# Altium schematic sheet Sheet3.SchDoc
size A
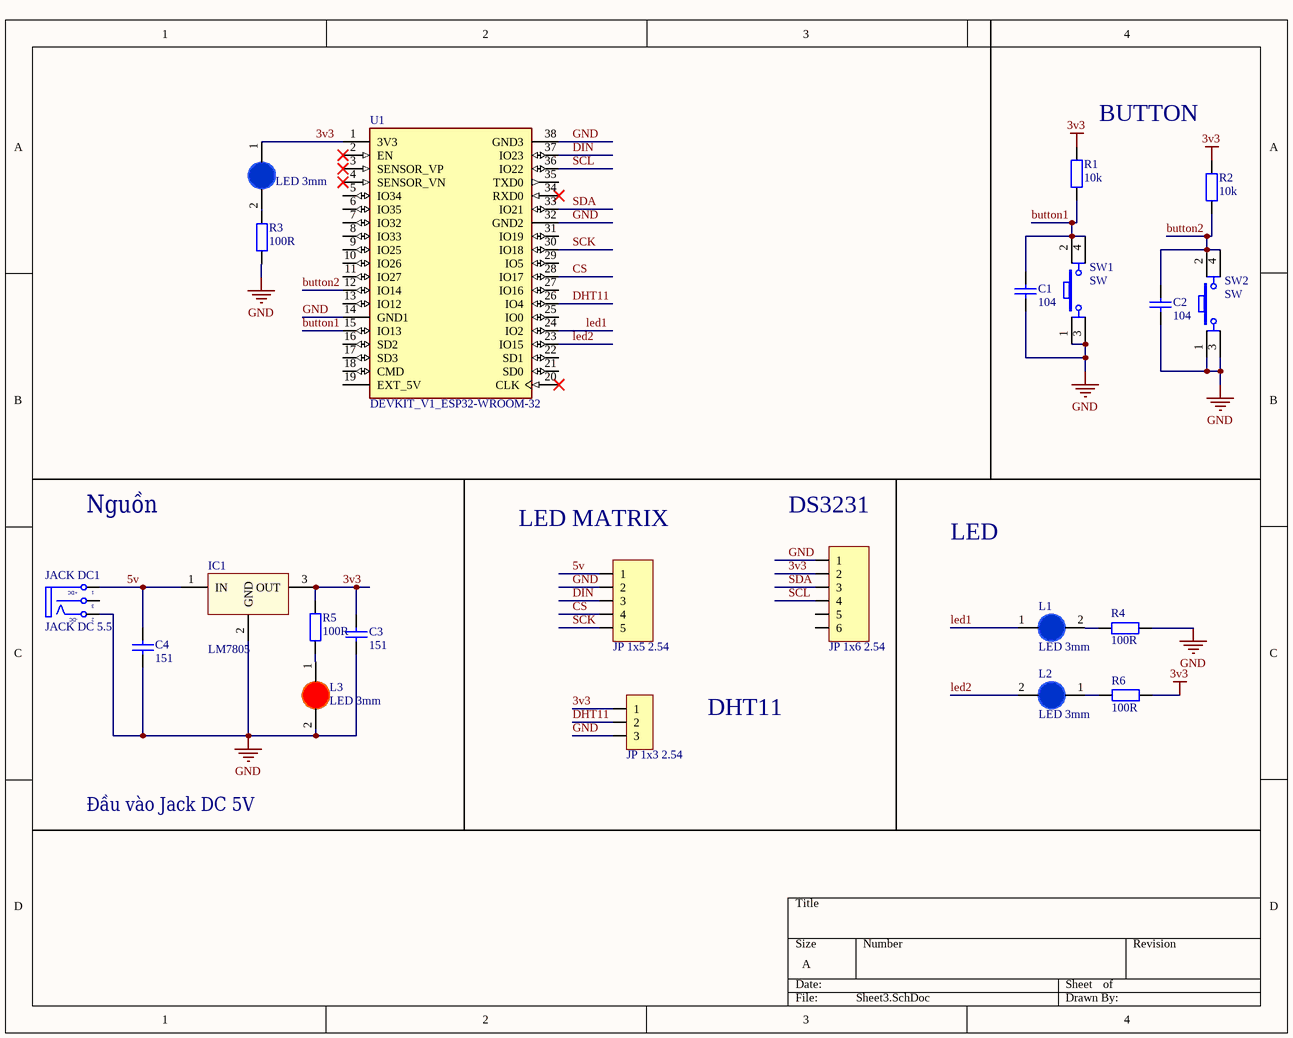
[diagram p0: Sheet3.SchDoc]

## Parts
?  LED 3mm  [LED-3MM-BLUE]
C1  104  [tu gom]
C2  104  [tu gom]
C3  151  [tu gom]
C4  151  [tu gom]
IC1  LM7805  [QTO-220H3]
JACK_DC1  JACK DC 5.5  [JACK DC 5.5]
JP1  JP 1x6 2.54  [JP 1x6 DT]
JP2  JP 1x5 2.54  [JP 1x5 DT]
JP3  JP 1x3 2.54  [JP 1x3 CT]
L1  LED 3mm  [LED-3MM-BLUE]
L2  LED 3mm  [LED-3MM-BLUE]
L3  LED 3mm  [LED-3MM-RED]
R1  10k  [tro vach 1/4w]
R2  10k  [tro vach 1/4w]
R3  100R  [tro vach 1/4w]
R4  100R  [tro vach 1/4w]
R5  100R  [tro vach 1/4w]
R6  100R  [tro vach 1/4w]
SW1  SW  [SW4]
SW2  SW  [SW4]
U1  DEVKIT_V1_ESP32-WROOM-32  [MODULE_DEVKIT_V1_ESP32-WROOM-32]

## Nets
3v3: ?.1(A) C3.1 IC1.3(OUT) JP1.2 JP3.1 R1.2 R2.2 R5.2 R6.1 U1.1(3V3)
GND: C1.2 C2.2 C3.2 C4.2 IC1.2(GND) JACK_DC1.2(TN) JP1.1 JP2.2 JP3.3 L3.2(K) R3.2 R4.1 SW1.1 SW1.3 SW2.1 SW2.3 U1.14(GND1) U1.32(GND2) U1.38(GND3)
5v: C4.1 IC1.1(IN) JACK_DC1.1(T) JP2.1
button1: C1.1 R1.1 SW1.2 SW1.4 U1.15(IO13)
button2: C2.1 R2.1 SW2.2 SW2.4 U1.12(IO14)
CS: JP2.4 U1.28(IO17)
DHT11: JP3.2 U1.26(IO4)
DIN: JP2.3 U1.37(IO23)
led1: L1.1(A) U1.24(IO2)
led2: L2.2(K) U1.23(IO15)
SCK: JP2.5 U1.30(IO18)
SCL: JP1.4 U1.36(IO22)
SDA: JP1.3 U1.33(IO21)
Net?_2: ?.2(K) R3.1
NetL1_2: L1.2(K) R4.2
NetL2_1: L2.1(A) R6.2
NetL3_1: L3.1(A) R5.1

Not connected (* = marked no-connect by the designer): JACK_DC1 3(S); JP1 5 6; U1 2(EN)* 3(SENSOR_VP)* 4(SENSOR_VN)* 5(IO34) 6(IO35) 7(IO32) 8(IO33) 9(IO25) 10(IO26) 11(IO27) 13(IO12) 16(SD2) 17(SD3) 18(CMD) 19(EXT_5V) 20(CLK)* 21(SD0) 22(SD1) 25(IO0) 27(IO16) 29(IO5) 31(IO19) 34(RXD0)* 35(TXD0)

## Notes on the sheet
- BUTTON
- Nguồn
- (near JP1) DS3231
- (near JP2) LED MATRIX
- LED
- DHT11
- Đầu vào Jack DC 5V
- (in symbol JACK DC 5.5) +DC; -DC

## Library data of the parts
? L1 L2 = LED 3mm Xanh Duong: Cắm; Don_Vi: Con; Ma_Hang: MH009003; Ten_Linh_Kien: LED 3MM Xanh Dương SS (1000c); Ghi_Chu: *; Kieu_Chan: *; Chung_Loai: Cắm
C1 C2 = Tu gom 104 50V: Cắm; So_Chan: 2; Ten_Linh_Kien: Tụ gốm 104 100nF 50V; Don_Vi: Con; Ma_Hang: MH004761; Chung_Loai: Cắm; Kieu_Chan: *
C3 C4 = Tu gom 151 50V: Cắm; So_Chan: 2; Don_Vi: Con; Ten_Linh_Kien: Tụ gốm 150P 151 50V; Ma_Hang: MH004766; Chung_Loai: Cắm; Kieu_Chan: *
IC1 = LM78xx: On ap +, from + 5 to + 24VDC; Value: LM7805
JACK_DC1 = JACK DC 5.5: Value: Jac DC
JP1 = JP 1x6 2.54 Duc Thang: Cắm; Ten_Linh_Kien: Jump Đơn Đực 2.54MM 1x40P Thẳng 11MM; Don_Vi: Con; Ma_Hang: MH000903; Ghi_Chu: *; Kieu_Chan: *; Chung_Loai: Cắm
JP2 = JP 1x5 2.54 Duc Thang: Cắm; Ten_Linh_Kien: Jump Đơn Đực 2.54MM 1x40P Thẳng 11MM; Don_Vi: Con; Ma_Hang: MH000903; Ghi_Chu: *; Kieu_Chan: *; Chung_Loai: Cắm
JP3 = JP 1x3 2.54 Cai Thang: Cắm; Ten_Linh_Kien: Jump Đơn Cái 2.54MM 1x20P Thẳng; Don_Vi: Con; Ma_Hang: MH004006; Ghi_Chu: *; Kieu_Chan: *; Chung_Loai: Cắm
L3 = LED 3mm Do: Cắm; Don_Vi: Con; Ma_Hang: MH003892; Ten_Linh_Kien: Led 3MM Phủ Đỏ (10c); Ghi_Chu: *; Kieu_Chan: *; Chung_Loai: Cắm
R1 R2 = Tro Vach 1/4W 5% 10k: Căm; Chung_Loai: Cắm; Don_Vi: Con; So_Chan: 2; Ten_Linh_Kien: Trở Vạch 1/4w 5% 10K; Ma_Hang: MH007354; Kieu_Chan: *
R3-R6 = Tro Vach 1/4W 5% 100R: Cắm; Don_Vi: Con; So_Chan: 2; Ten_Linh_Kien: Trở Vạch 1/4w 5% 100R; Ma_Hang: MH007353; Chung_Loai: Cắm; Kieu_Chan: *
SW1 SW2 = SW4: Switch button 4 pin; Value: Button chip 4 pin
U1 = DEVKIT_V1_ESP32-WROOM-32: WROOM-32 Development Board ESP32 ESP-32S WiFi Bluetooth Dev Module; MF: Espressif Systems; MP: DEVKIT V1 ESP32-WROOM-32; SnapEDA_Link: https://www.snapeda.com/parts/DEVKIT%20V1%20ESP32-WROOM-32/Espressif+Systems/view-part/?ref=snap; Package: Package; Value: *; Check_prices: https://www.snapeda.com/parts/DEVKIT%20V1%20ESP32-WROOM-32/Espressif+Systems/view-part/?ref=eda